# Altium schematic sheet SBRadio.SchDoc
size A4
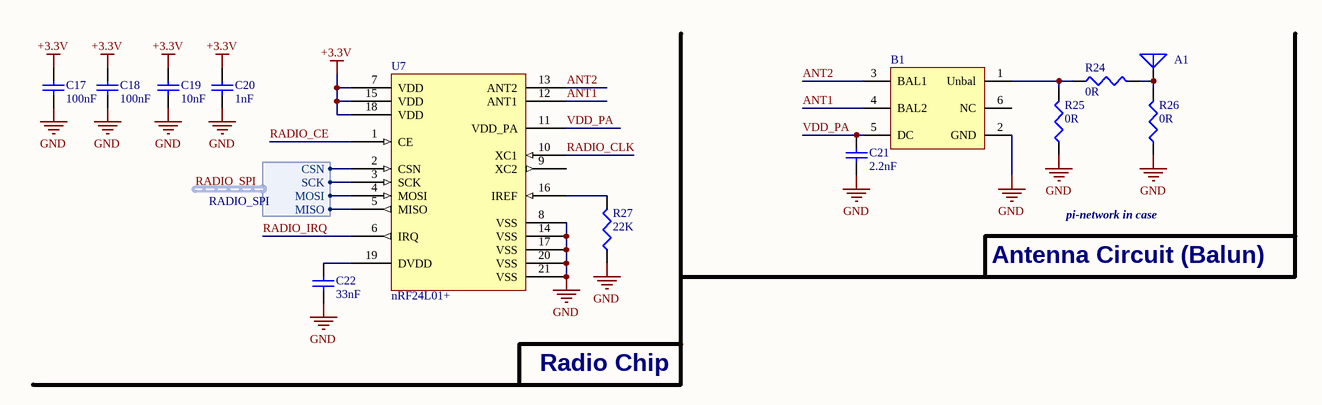
[diagram p0: SBRadio.SchDoc]

## Parts
A1  2450AT18D0100  [2450AT18D0100]  (value not drawn)
B1  2450BM14A0002T  [2450BM14A0002]  (value not drawn)
C17  100nF  [0402]
C18  100nF  [0402]
C19  10nF  [0402]
C20  1nF  [0402]
C21  2.2nF  [0402]
C22  33nF  [0402]
R24  0R  [0402]
R25  0R  [0402]
R26  0R  [0402]
R27  value 22K  [0402]  (hidden comment: 22K 0402 1/16W ±1%)
U7  nRF24L01+  [QFN50P400X400X95_HS-21L]

## Harnesses
RADIO_SPI: MOSI, MISO, SCK, CSN

## Nets
+3.3V: C17.2 C18.2 C19.2 C20.2 U7.7(VDD) U7.15(VDD) U7.18(VDD)
GND: A1.2(GND) B1.2(GND) C17.1 C18.1 C19.1 C20.1 C21.1 C22.1 R25.1 R26.1 R27.1 U7.8(VSS) U7.14(VSS) U7.17(VSS) U7.20(VSS) U7.21(VSS)
ANT1: B1.4(BAL2) U7.12(ANT1)
ANT2: B1.3(BAL1) U7.13(ANT2)
RADIO_CE: U7.1(CE)
RADIO_CLK: U7.10(XC1)
RADIO_IRQ: U7.6(IRQ)
RADIO_SPI.CSN: U7.2(CSN) ; harness RADIO_SPI.CSN
RADIO_SPI.MISO: U7.5(MISO) ; harness RADIO_SPI.MISO
RADIO_SPI.MOSI: U7.4(MOSI) ; harness RADIO_SPI.MOSI
RADIO_SPI.SCK: U7.3(SCK) ; harness RADIO_SPI.SCK
VDD_PA: B1.5(DC) C21.2 U7.11(VDD_PA)
NetA1_1: A1.1(A) R24.2 R26.2
NetB1_1: B1.1(Unbal) R24.1 R25.2
NetC22_2: C22.2 U7.19(DVDD)
NetR27_2: R27.2 U7.16(IREF)

Not connected (* = marked no-connect by the designer): B1 6(NC); U7 9(XC2)

## Notes on the sheet
- pi-network in case
- Antenna Circuit (Balun)
- Radio Chip

## Library data of the parts
A1 = 2450AT18D0100: JOHANSON TECHNOLOGY 2450AT18D0100  ANTENNA, CERAMIC, 2.45GHZ; Supplier 1: Mouser; Supplier 2: Digi-Key; Supplier Part Number 1: 609-2450AT18D0100E; Supplier Part Number 2: 712-1573-1-ND
B1 = 2450BM14A0002T: Johanson Technology Impedance Matched Balun Filter Integrated Passive for nRF24L01; Supplier 1: Farnell; Supplier 2: Digi-Key; Supplier Part Number 1: 2148533; Supplier Part Number 2: 712-1574-1-ND
C17 C18 = 100nF: 100nF 0402 X7R 16V ±10%; Supplier 1: Farnell; Supplier Part Number 1: 1288252; Supplier 2: Digi-Key; Supplier Part Number 2: 399-3521-1-ND; Value: 100nF
C19 = 10nF: 10nF 0402 X7R 25V ±5%; Supplier 1: Farnell; Supplier Part Number 1: 1692285; Supplier 2: Digi-Key; Supplier Part Number 2: 399-1279-1-ND; Value: 10nF
C20 = 1nF: 1nF 0402 X7R 50V ±10%; Supplier 1: Farnell; Supplier 2: Digi-Key; Supplier Part Number 1: 1414573; Supplier Part Number 2: 399-1032-1-ND; Value: 1nF
C21 = 2.2nF: 2.2nF 0402 X7R 50V ±10%; Supplier 1: Farnell; Supplier 2: Digi-Key; Supplier Part Number 1: 1414582; Supplier Part Number 2: 399-3068-1-ND; Value: 2.2nF
C22 = 33nF: 33nF 0402 X7R 50V ±10%; Supplier 1: Farnell; Supplier 2: Digi-Key; Supplier Part Number 1: 2210826; Supplier Part Number 2: 445-7334-1-ND; Value: 33nF
R24-R26 = 0R: 0R 0402 1/16W ±0.05R; Supplier 1: Farnell; Supplier 2: Digi-Key; Supplier Part Number 1: 2072513; Supplier Part Number 2: P0.0JCT-ND; Value: 0R
R27 = 22K: Supplier 1: Farnell; Supplier 2: Digi-Key; Supplier Part Number 1: 2072781; Supplier Part Number 2: 541-22.0KLCT-ND
U7 = nRF24L01+: Nordic Semi Ultra low power 2.4GHz RF Transceiver IC; Supplier 1: Digi-Key; Supplier Part Number 1: 1490-1033-1-ND